# EasyEDA Pro project car1.eprj, schematic Schematic7
Board Name: 电机驱动板; Create Date: 2025-06-12; Page Name: P1; Project Name: car1; Schematic Name: Schematic7; Update Date: 2025-06-12; Company: 嘉立创EDA; Page Size: A4; Version: V1.0
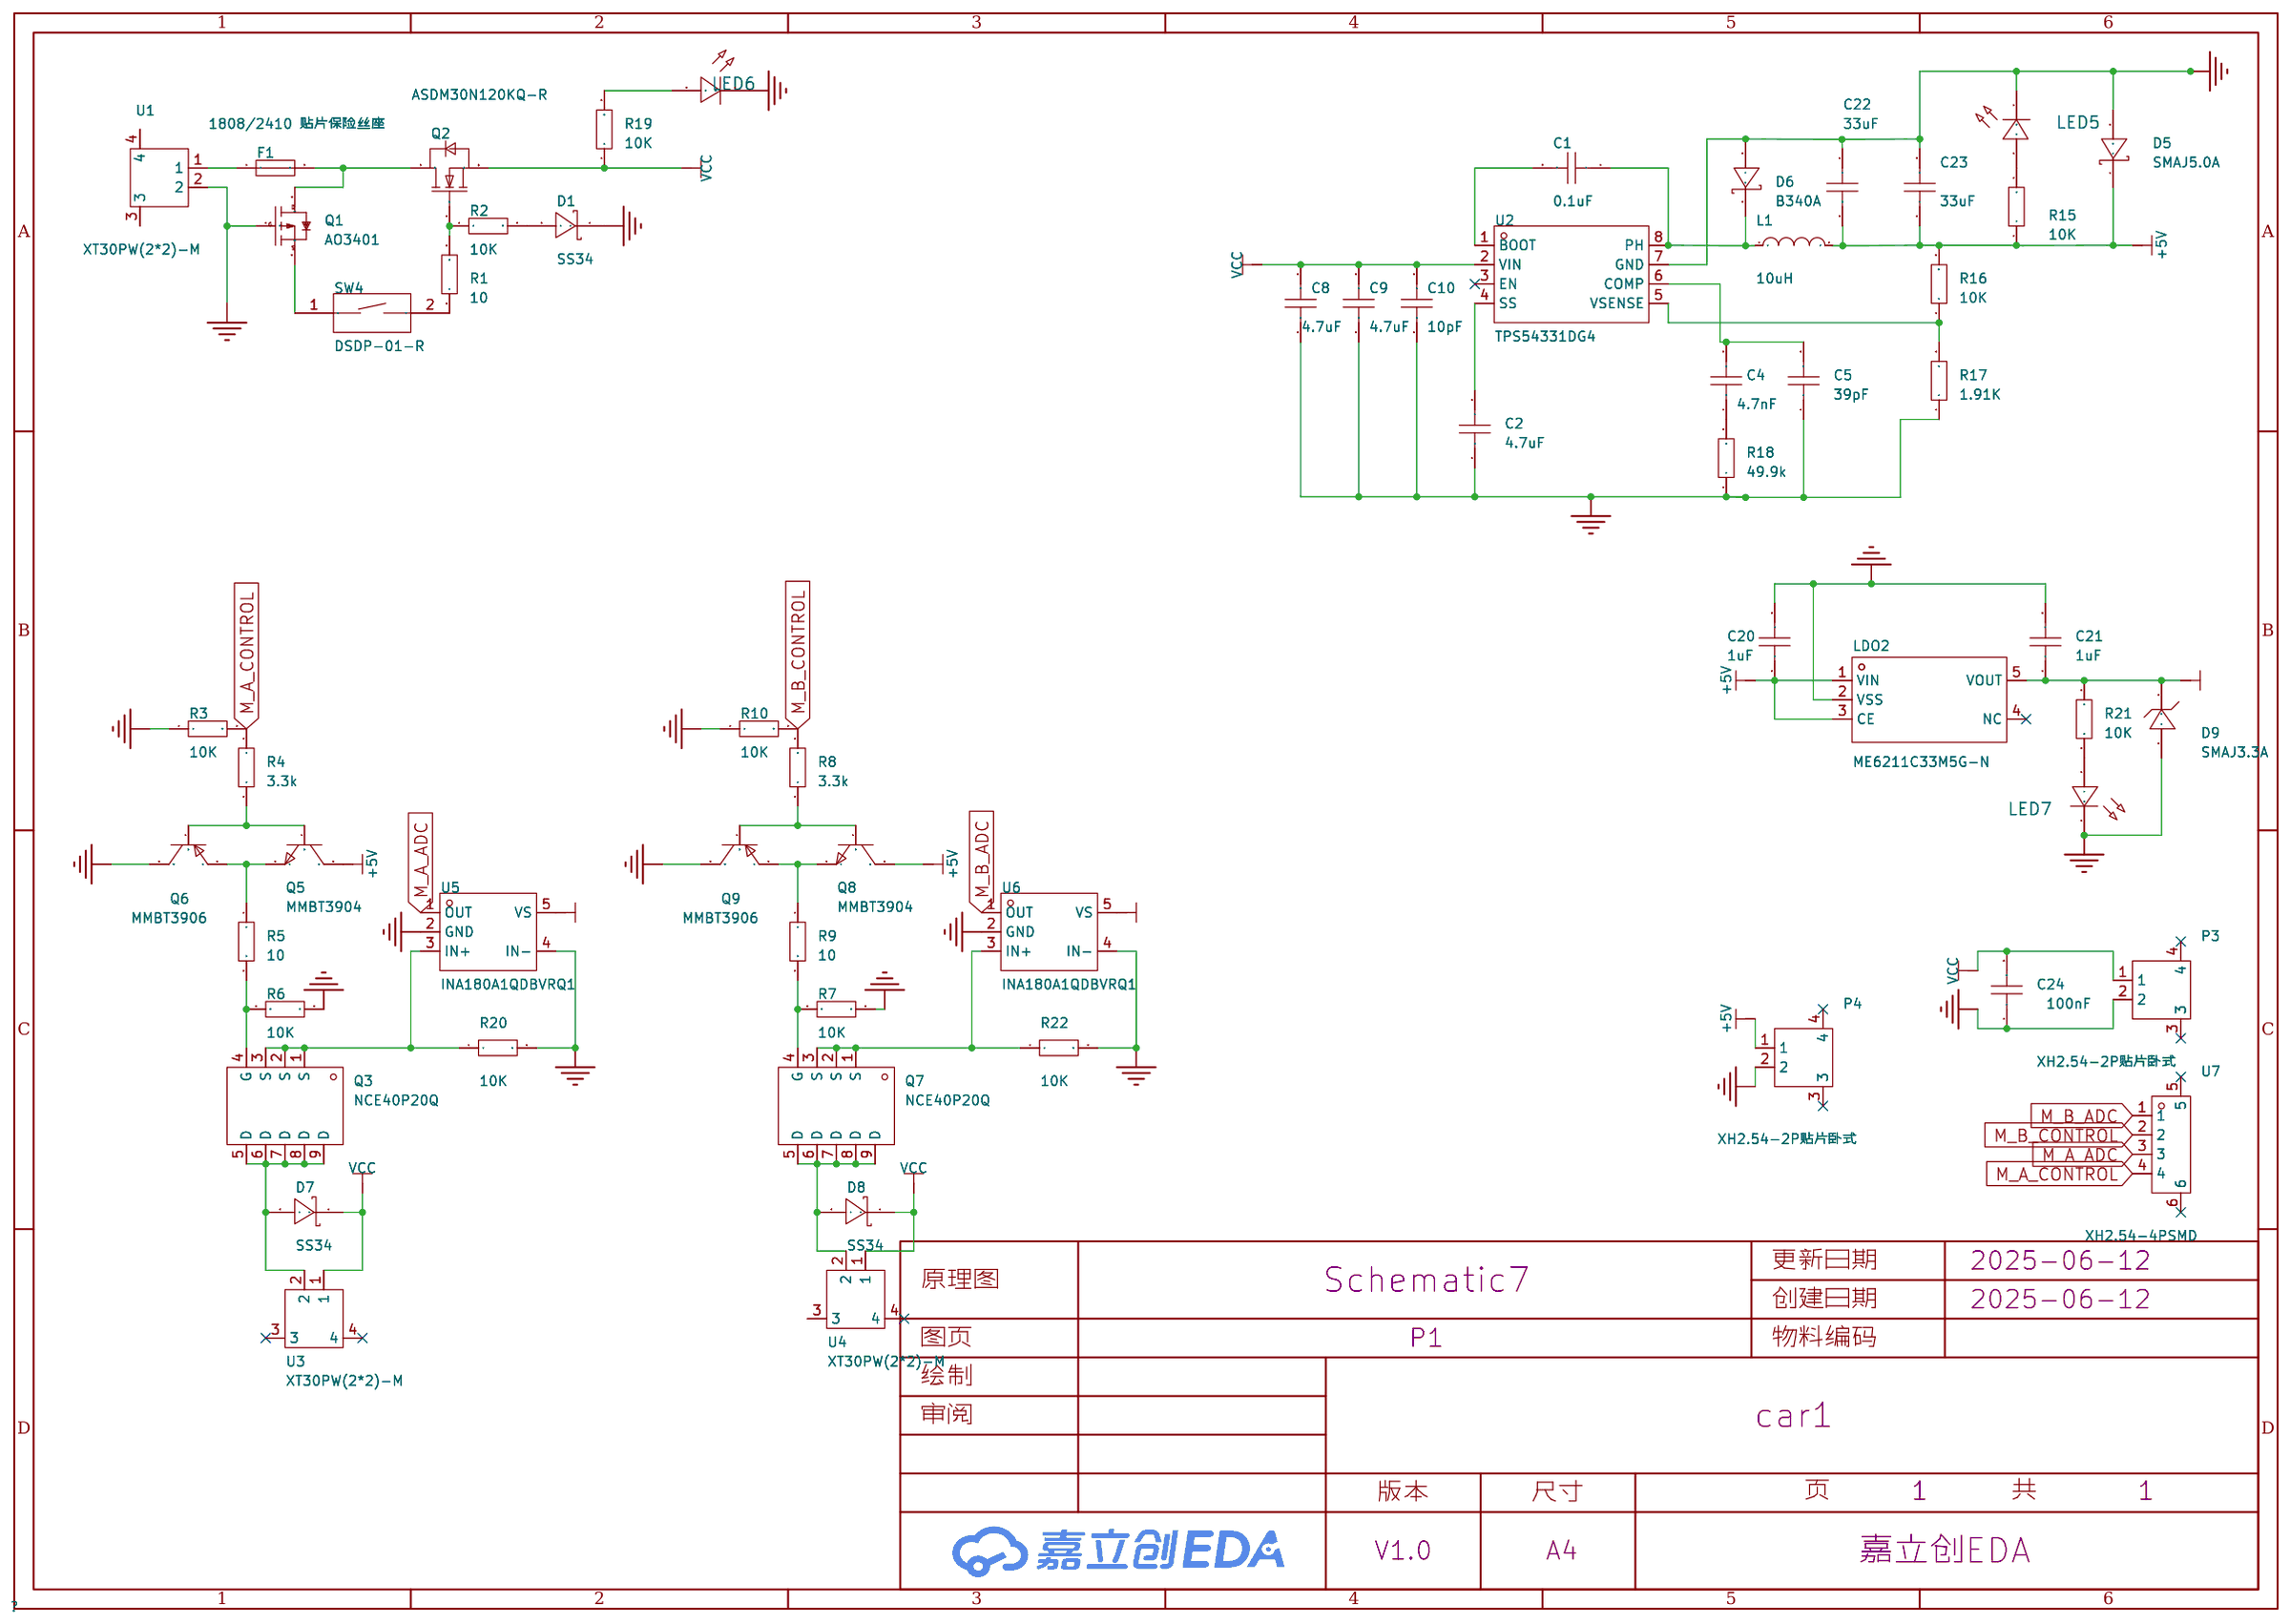
[diagram p11: schematic sheet]

## Parts
C1  0.1uF  [C0603]
C2  4.7uF  [C0603]
C4  4.7nF  [C0603]
C5  39pF  [C0603]
C8  4.7uF  [C0603]
C9  4.7uF  [C0603]
C10  10pF  [C0603]
C20  1uF  [C0603]
C21  1uF  [C0603]
C22  33uF  [C0603]
C23  33uF  [C0603]
C24  100nF  [C0603]
D1  SS34  [SMA_L4.3-W2.6-LS5.0-RD]
D5  SMAJ5.0A  [SMA_L4.4-W2.6-LS5.0-RD]
D6  B340A  [SMA_L4.3-W2.6-LS5.1-RD]
D7  SS34  [SMA_L4.3-W2.6-LS5.0-RD]
D8  SS34  [SMA_L4.3-W2.6-LS5.0-RD]
D9  SMAJ3.3A  [SMA_L4.3-W2.7-LS5.1-RD]
F1  1808/2410 贴片保险丝座  [FUSE-SMD_L9.7-W5.0]
L1  10uH  [IND-SMD_L4.9-W4.4_MAPM0420F]
LDO2  ME6211C33M5G-N  [SOT-23-5_L3.0-W1.7-P0.95-LS2.8-BL]
LED5  -  [LED_0603]
LED6  -  [LED_0603]
LED7  -  [LED_0603]
P3  XH2.54-2P贴片卧式  [CONN-SMD_2.54-2PWT]
P4  XH2.54-2P贴片卧式  [CONN-SMD_2.54-2PWT]
Q1  AO3401  [SOT-23-3_L2.9-W1.6-P1.90-LS2.8-BR]
Q2  ASDM30N120KQ-R  [TO-252-3_L6.5-W6.1-P4.58-TL]
Q3  NCE40P20Q  [DFN-8_L3.0-W3.0-P0.65-BL-4]
Q5  MMBT3904  [SOT-23-3_L2.9-W1.3-P1.90-LS2.4-BR]
Q6  MMBT3906  [SOT-23-3_L2.9-W1.3-P1.90-LS2.4-BR]
Q7  NCE40P20Q  [DFN-8_L3.0-W3.0-P0.65-BL-4]
Q8  MMBT3904  [SOT-23-3_L2.9-W1.3-P1.90-LS2.4-BR]
Q9  MMBT3906  [SOT-23-3_L2.9-W1.3-P1.90-LS2.4-BR]
R1  10  [R0603]
R2  10K  [R0603]
R3  10K  [R0603]
R4  3.3k  [R0603]
R5  10  [R0603]
R6  10K  [R0603]
R7  10K  [R0603]
R8  3.3k  [R0603]
R9  10  [R0603]
R10  10K  [R0603]
R15  10K  [R0603]
R16  10K  [R0603]
R17  1.91K  [R0603]
R18  49.9k  [R0603]
R19  10K  [R0603]
R20  10K  [R1206]
R21  10K  [R0603]
R22  10K  [R1206]
SW4  DSDP-01-R  [SW-TH_DSDP-01-R]
U1  XT30PW(2*2)-M  [CONN-TH_XT30PW-M]
U2  TPS54331DG4  [SOIC-8_L4.9-W3.9-P1.27-LS6.0-BL]
U3  XT30PW(2*2)-M  [CONN-TH_XT30PW-M]
U4  XT30PW(2*2)-M  [CONN-TH_XT30PW-M]
U5  INA180A1QDBVRQ1  [SOT-23-5_L2.9-W1.6-P0.95-LS2.8-TL]
U6  INA180A1QDBVRQ1  [SOT-23-5_L2.9-W1.6-P0.95-LS2.8-TL]
U7  XH2.54-4PSMD  [CONN-SMD_XH2.54-4PSMD]

## Library data of the parts
C1 = CAP_0402: MLCC; Supplier Footprint: 0402
C2 C4 C5 C8-C10 C20 C21 = CAP_0402: Supplier Footprint: 0402
C22-C24 = CAP_0603: Supplier Footprint: 0603
D1 D7 D8 = SS34: Supplier Part: C9900023345; Supplier Footprint: SMA,DO-214AC; JLCPCB Part Class: 扩展库; Supplier: LCSC
D5 = SMAJ5.0A: 反向截止电压(Vrwm):5V;最大钳位电压:9.2V;峰值脉冲电流(Ipp):43.5A;击穿电压:6.4V;; LCSC Part Name: 单向TVS; Supplier Part: C143135; Manufacturer: FMS(美丽微); Supplier Footprint: SMA(DO-214AC); JLCPCB Part Class: 扩展库; Datasheet: https://atta.szlcsc.com/upload/public/pdf/source/20181207/C341549_5F4FA613B7C5DCDA93DF59C5632A7235.pdf; Supplier: LCSC; Reverse Stand-Off Voltage (Vrwm): 5V; Maximum Clamping Voltage: 9.2V; Peak Pulse Current (Ipp): 43.5A; Breakdown Voltage: 6.4V; Type: TVS
D6 = B340A: 二极管配置:独立式;正向压降(Vf):550mV@3A;直流反向耐压(Vr):40V;整流电流:3A;; LCSC Part Name: 电压:40V 电流:3A; Supplier Part: C64982; Manufacturer: MDD(辰达半导体); Supplier Footprint: SMA(DO-214AC); JLCPCB Part Class: 扩展库; Datasheet: https://atta.szlcsc.com/upload/public/pdf/source/20240710/591710C3B34CDB7FE3DA92C119E6F598.pdf; Supplier: LCSC; Diode Configuration: 独立式; Forward Voltage (Vf@If): 550mV@3A; Reverse Voltage (Vr): 40V; Rectified Current: 3A; Reverse Leakage Current (Ir): 500uA@40V
D9 = SMAJ3.3A: 反向截止电压(Vrwm):3.3V;钳位电压:8.3V;峰值脉冲电流(Ipp):25A;击穿电压:4.2V;; LCSC Part Name: 单向TVS 3.3V截止 25A峰值脉冲; Supplier Part: C2917853; Manufacturer: ZHIDE(志得); Supplier Footprint: SMA; JLCPCB Part Class: 扩展库; Datasheet: https://atta.szlcsc.com/upload/public/pdf/source/20211123/CCA4B0E600B5A566CDC39785DC4CF110.pdf; Supplier: LCSC; Reverse Stand-Off Voltage (Vrwm): 3.3V; Clamping Voltage: 8.3V; Peak Pulse Current (Ipp): 25A; Voltage - Breakdown: 4.2V; Reverse Leakage Current (Ir): 200uA; Type: TVS
F1 = 1808/2410 贴片保险丝座: Supplier Part: C9900023831; Supplier Footprint: 1808/2410; JLCPCB Part Class: 扩展库; Supplier: LCSC
L1 = HA42-4R7MT: 电感值:4.7uH;精度:±20%;额定电流:2A;饱和电流(Isat):3A;; LCSC Part Name: 4.7uH ±20% 3A; Supplier Part: C2936653; Manufacturer: FH(风华); Supplier Footprint: 0420; JLCPCB Part Class: 扩展库; Datasheet: https://atta.szlcsc.com/upload/public/pdf/source/20211228/DF5AAD1C624D1DACD739A51BD94418BC.pdf; Supplier: LCSC; Tolerance: ±20%; Rated Current: 2A; Saturation Current (Isat): 3A; DC Resistance (DCR): 150mΩ
LDO2 = ME6211C33M5G-N: 输出类型:固定;最大输入电压:6V;输出电压:3.3V;最大输出电流:500mA;电源纹波抑制比(PSRR):70dB;输出极性:正极;; LCSC Part Name: 输入6V 输出3.3V 500mA; Supplier Part: C82942; Manufacturer: MICRONE(南京微盟); Supplier Footprint: SOT-23-5; JLCPCB Part Class: 扩展库; Datasheet: https://atta.szlcsc.com/upload/public/pdf/source/20170918/C82942_1505727073070976520.pdf; Supplier: LCSC; Output Type: 固定; Maximum Input Voltage: 6V; Output Voltage: 3.3V; MAX Output Current: 500mA; Power Supply Rejection Ratio (PSRR): 70dB; Dropout Voltage: 260mV@(200mA); Output Polarity: 正极; Number of Outputs: 1
LED5-LED7 = LED_0603-R: Supplier Footprint: 0603
P3 P4 = XH2.54-2P贴片卧式: Supplier Part: C9900016890; Supplier Footprint: SMD_2P-P2.54MM_XH2.54-2AB; JLCPCB Part Class: 扩展库; Supplier: LCSC
Q1 = AO3401: Supplier Part: C9900008520; Supplier Footprint: SOT-23; JLCPCB Part Class: 扩展库; Supplier: LCSC
Q2 = ASDM30N120KQ-R: 类型:1个N沟道;漏源电压(Vdss):30V;连续漏极电流(Id):120A;导通电阻(RDS(on)@Vgs,Id):2.5mΩ@10V,30A;功率(Pd):45W;阈值电压(Vgs(th)@Id):1V@250uA;; LCSC Part Name: 1个N沟道 耐压:30V 电流:120A; Supplier Part: C2972858; Manufacturer: ASDsemi(安森德); Supplier Footprint: TO-252; JLCPCB Part Class: 扩展库; Datasheet: https://atta.szlcsc.com/upload/public/pdf/source/20220215/F4CF60705CEE8B1702CEE96B10933A1F.pdf; Supplier: LCSC; Type: 1个N沟道; Drain Source Voltage (Vdss): 30V; Continuous Drain Current (Id): 120A; Drain Source On Resistance (RDS(on)@Vgs,Id): 2.5mΩ@10V,30A; Power Dissipation (Pd): 45W; Gate Threshold Voltage (Vgs(th)@Id): 1V@250uA; Total Gate Charge (Qg@Vgs): 63nC@10V; Input Capacitance (Ciss@Vds): 2.921nF@15V; Reverse Transfer Capacitance (Crss@Vds): 416pF@15V; Operating Temperature: -55℃~+150℃
Q3 Q7 = NCE40P20Q: 类型:1个P沟道;漏源电压(Vdss):40V;功率(Pd):30W;阈值电压(Vgs(th)@Id):-;; LCSC Part Name: 1个P沟道 耐压:40V; Supplier Part: C2686564; Manufacturer: NCE(无锡新洁能); Supplier Footprint: DFN-8L(3.3x3.3); JLCPCB Part Class: 扩展库; Datasheet: https://atta.szlcsc.com/upload/public/pdf/source/20220809/AB5FD42DF7A81DEF3599B79A1C45926F.pdf; Supplier: LCSC; Type: 1个P沟道; Drain Source Voltage (Vdss): 40V; Power Dissipation (Pd): 30W; Operating Temperature: -55℃~+150℃
Q5 Q8 = MMBT3904(RANGE:100-300): 晶体管类型:NPN;集电极电流(Ic):200mA;集射极击穿电压(Vceo):40V;功率(Pd):200mW;直流电流增益(hFE@Ic,Vce):100@10mA,1V;; LCSC Part Name: NPN 电流:200mA 耐压:40V hfe=100~300; Supplier Part: C20526; Manufacturer: CJ(江苏长电/长晶); Supplier Footprint: SOT-23; JLCPCB Part Class: 基础库; Datasheet: https://atta.szlcsc.com/upload/public/pdf/source/20220704/70F575FB75061E03F919270A6BB8BA7F.pdf; Supplier: LCSC; Transistor Type: NPN; Collector Current (Ic): 200mA; Collector-Emitter Breakdown Voltage (Vceo): 40V; Power Dissipation (Pd): 200mW; DC Current Gain (hFE@Ic,Vce): 100@10mA,1V; Transition Frequency (fT): 300MHz; Collector Cut-Off Current (Icbo): 100nA; Collector-Emitter Saturation Voltage (VCE(sat)@Ic,Ib): 300mV@50mA,5mA
Q6 Q9 = MMBT3906_C18195368: Supplier Part: C18195368; Manufacturer: LJ(朗捷）; Supplier Footprint: SOT-23; Datasheet: https://atta.szlcsc.com/upload/public/pdf/source/20230921/EBEA0117477174C76530FD120E2EA419.pdf; Supplier: LCSC
R1-R5 R8-R10 R19 = Res_0603: Supplier Footprint: 0603
R6 R7 R15-R18 R21 = Res_0402: Supplier Footprint: 0402
R20 R22 = Res_1206: Supplier Footprint: 1206
SW4 = DSDP-01-R: 类型:琴键;开关位数:1位;颜色:红色;; LCSC Part Name: 琴键式拨码开关 2.54mm间距, 侧柄1PIN/位  红色侧拨 高推; Supplier Part: C7428559; Manufacturer: USAKRO(美韩); Supplier Footprint: 插件; JLCPCB Part Class: 扩展库; Datasheet: https://atta.szlcsc.com/upload/public/pdf/source/20230629/19F8FC189B1E44D46AFE39BDECE17F2E.pdf; Supplier: LCSC; Type: 琴键; Number of Positions: 1位; Lead Pitch: 2.54mm; Color: 红色
U1 U3 U4 = XT30PW(2*2)-M: Supplier Part: C9900097120; JLCPCB Part Class: 扩展库; Supplier: LCSC
U2 = TPS54331DG4: 功能类型:降压型;输出类型:可调;输入电压:3.5V~28V;输出电压:800mV~25V;输出电流:3A;; Supplier Part: C1356164; Manufacturer: TI(德州仪器); Supplier Footprint: SOIC-8; JLCPCB Part Class: 扩展库; Datasheet: https://www.ti.com/cn/lit/gpn/tps54331; Supplier: LCSC; Function: 降压型; Output Type: 可调; Input Voltage: 3.5V~28V; Output Voltage: 800mV~25V; Output Current: 3A; Switching Frequency: 570kHz; Operating Temperature: -40℃~+150℃@(TJ); Synchronous Rectification: 否; Number of Outputs: 1; Topology: 降压式; Switch tube (built-in/external): 内置
U5 U6 = INA180A1QDBVRQ1: 放大器数:单路;; Supplier Part: C2058156; Manufacturer: TI(德州仪器); Supplier Footprint: SOT-23-5; JLCPCB Part Class: 扩展库; Datasheet: https://www.ti.com/cn/lit/gpn/ina2180-q1; Supplier: LCSC; Number of Channels: 单路; Supply Current: 197uA; Operating Temperature: -40℃~+125℃
U7 = XH2.54-4PSMD: Supplier Part: C9900001014; Supplier Footprint: XH2.54-4P; JLCPCB Part Class: 扩展库; Supplier: LCSC

## Nets
3.3V: C21.1 D9.1(C) LDO2.5(VOUT) R21.1 U5.5(VS) U6.5(VS)
+5V: C20.1 C23.1 D5.1(K) LDO2.1(VIN) LDO2.3(CE) P4.1 Q5.3(C) Q8.3(C) R15.1 R16.2
GND: C2.1 C5.1 C8.1 C9.1 C10.1 C20.2 C21.2 C22.1 C23.2 C24.1 D1.1(K) D5.2(A) D6.2(A) D9.2(A) LDO2.2(VSS) LED5.1(C) LED6.1(C) LED7.1(C) P3.2 P4.2 Q1.1(G) Q6.3(C) Q9.3(C) R3.1 R6.2 R7.2 R10.1 R17.1 R18.1 R20.2 R22.2 U1.2 U2.7(GND) U5.2(GND) U5.4(IN-) U6.2(GND) U6.4(IN-)
VCC: C8.2 C9.2 C10.2 C24.2 D7.1(K) D8.1(K) P3.1 Q2.3(S) R19.1 U2.2(VIN) U3.1 U4.1
M_A_ADC: U5.1(OUT) U7.3
M_A_CONTROL: R3.2 R4.1 U7.4
M_B_ADC: U6.1(OUT) U7.1
M_B_CONTROL: R8.1 R10.2 U7.2
$1N581: Q1.2(S) SW4.1
$1N638: Q2.1(G) R1.2 R2.1
$1N733: D1.2(A) R2.2
$1N858: F1.1 U1.1
$1N864: F1.2 Q1.3(D) Q2.2(D)
$1N1355: D7.2(A) Q3.5(D) Q3.6(D) Q3.7(D) Q3.8(D) Q3.9(D) U3.2
$1N1644: Q5.1(B) Q6.1(B) R4.2
$1N1648: Q5.2(E) Q6.2(E) R5.1
$1N1651: Q3.4(G) R5.2 R6.1
$1N2048: D8.2(A) Q7.5(D) Q7.6(D) Q7.7(D) Q7.8(D) Q7.9(D) U4.2
$1N2059: Q8.1(B) Q9.1(B) R8.2
$1N2062: Q8.2(E) Q9.2(E) R9.1
$1N2063: Q7.4(G) R7.1 R9.2
$1N2629: C1.2 U2.1(BOOT)
$1N2631: C2.2 U2.4(SS)
$1N2635: R16.1 R17.2 U2.5(VSENSE)
$1N2636: C4.2 C5.2 U2.6(COMP)
$1N2637: C4.1 R18.2
$1N2638: LED5.2(A) R15.2
$1N4376: LED6.2(A) R19.2
$1N5508: Q3.1(S) Q3.2(S) Q3.3(S) R20.1 U5.3(IN+)
$1N6906: LED7.2(A) R21.2
$1N7105: Q7.1(S) Q7.2(S) Q7.3(S) R22.1 U6.3(IN+)
$1N7723: R1.1 SW4.2
Net-(C1-1): C1.1 D6.1(K) U2.8(PH)

Not connected (* = marked no-connect by the designer): C22 2; L1 1 2; LDO2 4(NC)*; P3 3* 4*; P4 3* 4*; U1 3 4; U2 3(EN)*; U3 3* 4*; U4 3 4*; U7 5* 6*
